# Altium schematic sheet CATS-Vega-GNSS.SchDoc: CATS Vega
size A4; Author: Luca Jost; Revision: V1.0; SheetNumber: 16; SheetTotal: 16; Subtitle: GNSS
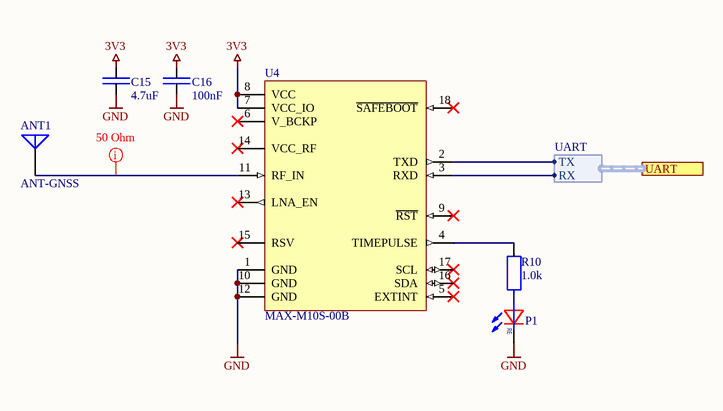
[diagram p0: CATS-Vega-GNSS.SchDoc]

## Parts
ANT1  ANT-GNSS  [THT Antenna GNSS 18x18]
C15  4.7uF  [SMD Keramikkondensator 0603]
C16  100nF  [SMD Keramikkondensator 0603]
P1  LED  [SMD LED 0603]  (value not drawn)
R10  1.0k  [SMD Widerstand 0603]
U4  MAX-M10S-00B  [SMD MAX-8]

## Ports
UART (harness UART)

## Harnesses
UART: TX, RX

## Nets
3V3: C15.2 C16.2 U4.7(VCC_IO) U4.8(VCC)
GND: C15.1 C16.1 P1.K U4.1(GND) U4.10(GND) U4.12(GND)
NetANT1_1: ANT1.1 U4.11(RF_IN)
NetP1_A: P1.A R10.1
NetR10_2: R10.2 U4.4(TIMEPULSE)
NetU4_2: U4.2(TXD) ; port UART.TX
NetU4_3: U4.3(RXD) ; port UART.RX

Not connected (* = marked no-connect by the designer): U4 5(EXTINT)* 6(V_BCKP)* 9(~{RST})* 13(LNA_EN)* 14(VCC_RF)* 15(RSV)* 16(SDA)* 17(SCL)* 18(~{SAFEBOOT})*

## Layout directives
rule Impedance Constraint [Min = 50.00    Max = 50.00    ]; net class RF-Line 50: NetANT1_1

## Notes on the sheet
- Title
- Author:
- Subtitle
- Date:
- Rev:
- File:
- Sheet
- of
- (in symbol LED) RE

## Library data of the parts
ANT1 = ANT-GNSS: 1.575GHz, 1.602GHz Beidou, Galileo, GLONASS, GNSS, GPS Ceramic Patch RF Antenna 1.567GHz ~ 1.609GHz 5.1dBi, 2.8dBi, 4dBi Pin Adhesive; ComponentLink1Description: Datasheet; ComponentLink1URL: https://abracon.com/patchantenna/APAE1575R1820ABDC1-T.pdf; Digikey: 343-ANT-GNSSCP-TH18L1-ND; Mouser: 712-ANTGNSSCP-TH18L1; Unit Price: 1.63
C15 = E6 - 4.7uF: SMD Ceramic Capacitor E6; Unit Price: 0.0082; JLC: C19666
C16 = E6 - 100nF: SMD Ceramic Capacitor E6; Unit Price: 0.0024; JLC: C1591
P1 = LED: Color LED; JLC: C84263; Unit Price: 0.01
R10 = E24 - 1.0k: SMD Chip Resistor E24; Unit Price: 0.001; JLC: C2907113
U4 = MAX-M10S-00B: u-blox 8 GNSS modules; ComponentLink1Description: Datasheet; ComponentLink1URL: https://content.u-blox.com/sites/default/files/MAX-M10S_DataSheet_UBX-20035208.pdf; Digikey: 672-MAX-M10S-00BTR-ND; Unit Price: 14.16; Mouser: 377-MAX-M10S-00B